# EAGLE design board (EAGLE 6.6.0)
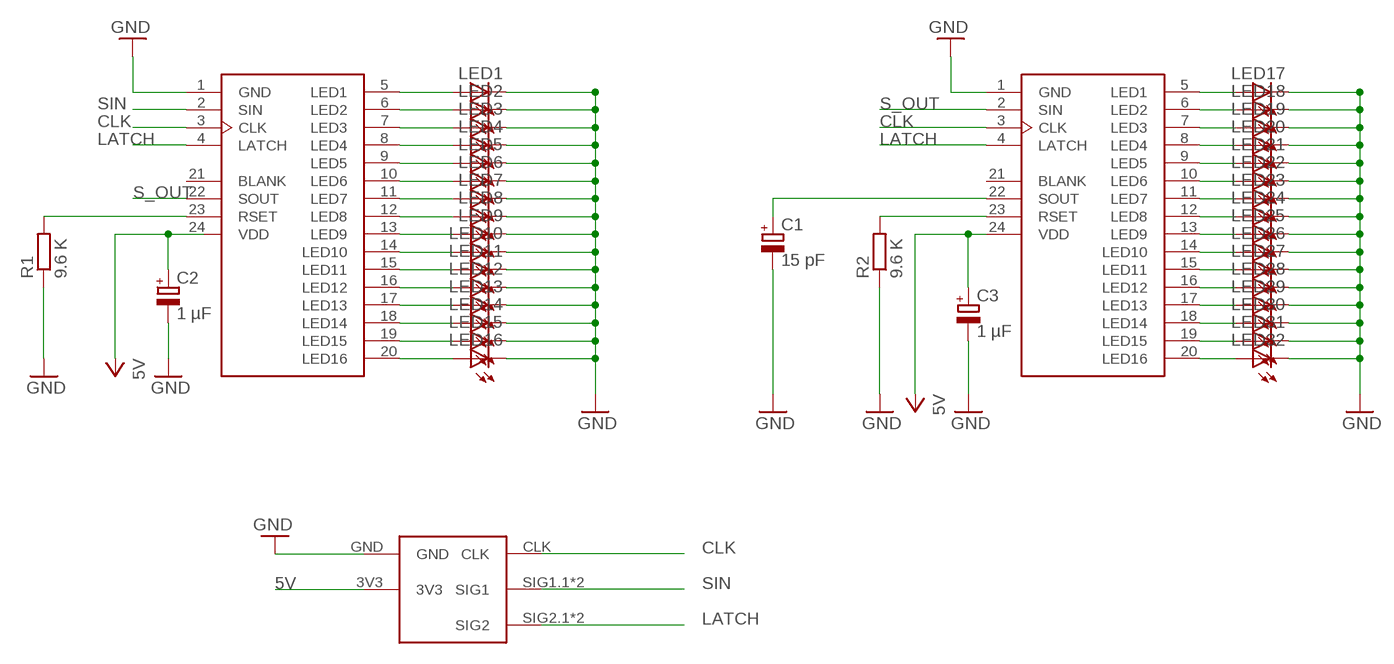
[diagram p0: schematic, sheet 1]

## Parts
C1  15 pF  CPOL-EUE5-8.5  [E5-8,5]
C2  1 µF  CPOL-EUE5-8.5  [E5-8,5]
C3  1 µF  CPOL-EUE5-8.5  [E5-8,5]
IC1  CAT4016  [SOIC24W]
IC2  CAT4016  [SOIC24W]
LED1  LEDCHIPLED-0603-TTW  [CHIPLED-0603-TTW]
LED2  LEDCHIPLED-0603-TTW  [CHIPLED-0603-TTW]
LED3  LEDCHIPLED-0603-TTW  [CHIPLED-0603-TTW]
LED4  LEDCHIPLED-0603-TTW  [CHIPLED-0603-TTW]
LED5  LEDCHIPLED-0603-TTW  [CHIPLED-0603-TTW]
LED6  LEDCHIPLED-0603-TTW  [CHIPLED-0603-TTW]
LED7  LEDCHIPLED-0603-TTW  [CHIPLED-0603-TTW]
LED8  LEDCHIPLED-0603-TTW  [CHIPLED-0603-TTW]
LED9  LEDCHIPLED-0603-TTW  [CHIPLED-0603-TTW]
LED10  LEDCHIPLED-0603-TTW  [CHIPLED-0603-TTW]
LED11  LEDCHIPLED-0603-TTW  [CHIPLED-0603-TTW]
LED12  LEDCHIPLED-0603-TTW  [CHIPLED-0603-TTW]
LED13  LEDCHIPLED-0603-TTW  [CHIPLED-0603-TTW]
LED14  LEDCHIPLED-0603-TTW  [CHIPLED-0603-TTW]
LED15  LEDCHIPLED-0603-TTW  [CHIPLED-0603-TTW]
LED16  LEDCHIPLED-0603-TTW  [CHIPLED-0603-TTW]
LED17  LEDCHIPLED-0603-TTW  [CHIPLED-0603-TTW]
LED18  LEDCHIPLED-0603-TTW  [CHIPLED-0603-TTW]
LED19  LEDCHIPLED-0603-TTW  [CHIPLED-0603-TTW]
LED20  LEDCHIPLED-0603-TTW  [CHIPLED-0603-TTW]
LED21  LEDCHIPLED-0603-TTW  [CHIPLED-0603-TTW]
LED22  LEDCHIPLED-0603-TTW  [CHIPLED-0603-TTW]
LED23  LEDCHIPLED-0603-TTW  [CHIPLED-0603-TTW]
LED24  LEDCHIPLED-0603-TTW  [CHIPLED-0603-TTW]
LED25  LEDCHIPLED-0603-TTW  [CHIPLED-0603-TTW]
LED26  LEDCHIPLED-0603-TTW  [CHIPLED-0603-TTW]
LED27  LEDCHIPLED-0603-TTW  [CHIPLED-0603-TTW]
LED28  LEDCHIPLED-0603-TTW  [CHIPLED-0603-TTW]
LED29  LEDCHIPLED-0603-TTW  [CHIPLED-0603-TTW]
LED30  LEDCHIPLED-0603-TTW  [CHIPLED-0603-TTW]
LED31  LEDCHIPLED-0603-TTW  [CHIPLED-0603-TTW]
LED32  LEDCHIPLED-0603-TTW  [CHIPLED-0603-TTW]
R1  9.6 K  R-EU_0207/10  [0207/10]
R2  9.6 K  R-EU_0207/10  [0207/10]
U$1  SLIP-RING-INVERSE  [SLIP-RING-INVERSE]

## Nets
5V: C2.+ C3.+ IC2.24(VDD) U$1.3V3
C1: C1.+ IC2.22(SOUT)
CLK: IC1.3(CLK) IC2.3(CLK) U$1.CLK
GND: C1.- C2.- C3.- IC1.1(GND) IC2.1(GND) LED1.C@1(C) LED2.C@1(C) LED3.C@1(C) LED4.C@1(C) LED5.C@1(C) LED6.C@1(C) LED7.C@1(C) LED8.C@1(C) LED9.C@1(C) LED10.C@1(C) LED11.C@1(C) LED12.C@1(C) LED13.C@1(C) LED14.C@1(C) LED15.C@1(C) LED16.C@1(C) LED17.C@1(C) LED18.C@1(C) LED19.C@1(C) LED20.C@1(C) LED21.C@1(C) LED22.C@1(C) LED23.C@1(C) LED24.C@1(C) LED25.C@1(C) LED26.C@1(C) LED27.C@1(C) LED28.C@1(C) LED29.C@1(C) LED30.C@1(C) LED31.C@1(C) LED32.C@1(C) R1.1 R2.1 U$1.GND
LATCH: IC1.4(LATCH) IC2.4(LATCH) U$1.SIG2.1(SIG2) U$1.SIG2.2(SIG2)
N$1: IC1.23(RSET) R1.2
N$2: IC2.23(RSET) R2.2
N$3: IC2.20(LED16) LED32.A@1(A)
N$4: IC2.19(LED15) LED31.A@1(A)
N$5: IC2.18(LED14) LED30.A@1(A)
N$6: IC2.17(LED13) LED29.A@1(A)
N$7: IC2.16(LED12) LED28.A@1(A)
N$8: IC2.15(LED11) LED27.A@1(A)
N$9: IC2.14(LED10) LED26.A@1(A)
N$10: IC2.13(LED9) LED25.A@1(A)
N$11: IC2.5(LED1) LED17.A@1(A)
N$12: IC2.6(LED2) LED18.A@1(A)
N$13: IC2.7(LED3) LED19.A@1(A)
N$14: IC2.8(LED4) LED20.A@1(A)
N$15: IC2.9(LED5) LED21.A@1(A)
N$16: IC2.10(LED6) LED22.A@1(A)
N$17: IC2.11(LED7) LED23.A@1(A)
N$18: IC2.12(LED8) LED24.A@1(A)
N$19: IC1.5(LED1) LED1.A@1(A)
N$20: IC1.6(LED2) LED2.A@1(A)
N$21: IC1.7(LED3) LED3.A@1(A)
N$22: IC1.8(LED4) LED4.A@1(A)
N$23: IC1.9(LED5) LED5.A@1(A)
N$24: IC1.10(LED6) LED6.A@1(A)
N$25: IC1.11(LED7) LED7.A@1(A)
N$26: IC1.12(LED8) LED8.A@1(A)
N$27: IC1.13(LED9) LED9.A@1(A)
N$28: IC1.14(LED10) LED10.A@1(A)
N$29: IC1.15(LED11) LED11.A@1(A)
N$30: IC1.16(LED12) LED12.A@1(A)
N$31: IC1.17(LED13) LED13.A@1(A)
N$32: IC1.18(LED14) LED14.A@1(A)
N$33: IC1.19(LED15) LED15.A@1(A)
N$34: IC1.20(LED16) LED16.A@1(A)
S_OUT: IC1.22(SOUT) IC2.2(SIN)
SIN: IC1.2(SIN) U$1.SIG1.1(SIG1) U$1.SIG1.2(SIG1)
Unconnected: IC1.21(BLANK) IC1.24(VDD) IC2.21(BLANK)

## Library data of the parts
C1-C3 = rcl:CPOL-EU: POLARIZED CAPACITOR, European symbol
IC1 IC2 = cat4016:CAT4016: 16-Channel Constant Current LED Driver
LED1-LED32 = led:LED: LED OSRAM: - CHIPLED LG R971, LG N971, LY N971, LG Q971, LY Q971, LO R971, LY R971 LH N974, LH R974 LS Q976, LO Q976, LY Q976 LO Q996 - Hyper CHIPLED LW Q18S LB Q993, LB Q99A, LB R99A - SideLED LS A670, LO A670, LY A670, LG A670, LP A670 LB A673, LV A673, LT A673, LW A673 LH A674 LY A675 LS A676, LA A676, LO A676, LY A676, LW A676 LS A679, LY A679, LG A679 - Hyper Micro SIDELED® LS Y876, LA Y876, LO Y876, LY Y876 LT Y87S - SmartLED LW L88C, LW L88S LB L89C, LB L89S, LG L890 LS L89K, LO L89K, LY L89K LS L896, LA L896, LO L896, LY L896 - TOPLED LS T670, LO T670, LY T670, LG T670, LP T670 LSG T670, LSP T670, LSY T670, LOP T670, LYG T670 LG T671, LOG T671, LSG T671 LB T673, LV T673, LT T673, LW T673 LH T674 LS T676, LA T676, LO T676, LY T676, LB T676, LH T676, LSB T676, LW T676 LB T67C, LV T67C, LT T67C, LS T67K, LO T67K, LY T67K, LW E67C LS E67B, LA E67B, LO E67B, LY E67B, LB E67C, LV E67C, LT E67C LW T67C LS T679, LY T679, LG T679 LS T770, LO T770, LY T770, LG T770, LP T770 LB T773, LV T773, LT T773, LW T773 LH T774 LS E675, LA E675, LY E675, LS T675 LS T776, LA T776, LO T776, LY T776, LB T776 LHGB T686 LT T68C, LB T68C - Hyper Mini TOPLED® LB M676 - Mini TOPLED Santana® LG M470 LS M47K, LO M47K, LY M47K Source: http://www.osram.convergy.de LUXEON: - LUMILED® LXK2-PW12-R00, LXK2-PW12-S00, LXK2-PW14-U00, LXK2-PW14-V00 LXK2-PM12-R00, LXK2-PM12-S00, LXK2-PM14-U00 LXK2-PE12-Q00, LXK2-PE12-R00, LXK2-PE12-S00, LXK2-PE14-T00, LXK2-PE14-U00 LXK2-PB12-K00, LXK2-PB12-L00, LXK2-PB12-M00, LXK2-PB14-N00, LXK2-PB14-P00, LXK2-PB14-Q00 LXK2-PR12-L00, LXK2-PR12-M00, LXK2-PR14-Q00, LXK2-PR14-R00 LXK2-PD12-Q00, LXK2-PD12-R00, LXK2-PD12-S00 LXK2-PH12-R00, LXK2-PH12-S00 LXK2-PL12-P00, LXK2-PL12-Q00, LXK2-PL12-R00 Source: www.luxeon.com KINGBRIGHT: KA-3528ASYC Source: www.kingbright.com
R1 R2 = resistor:R-EU_: RESISTOR, European symbol
U$1 = slip_ring:SLIP-RING-INVERSE

## Board
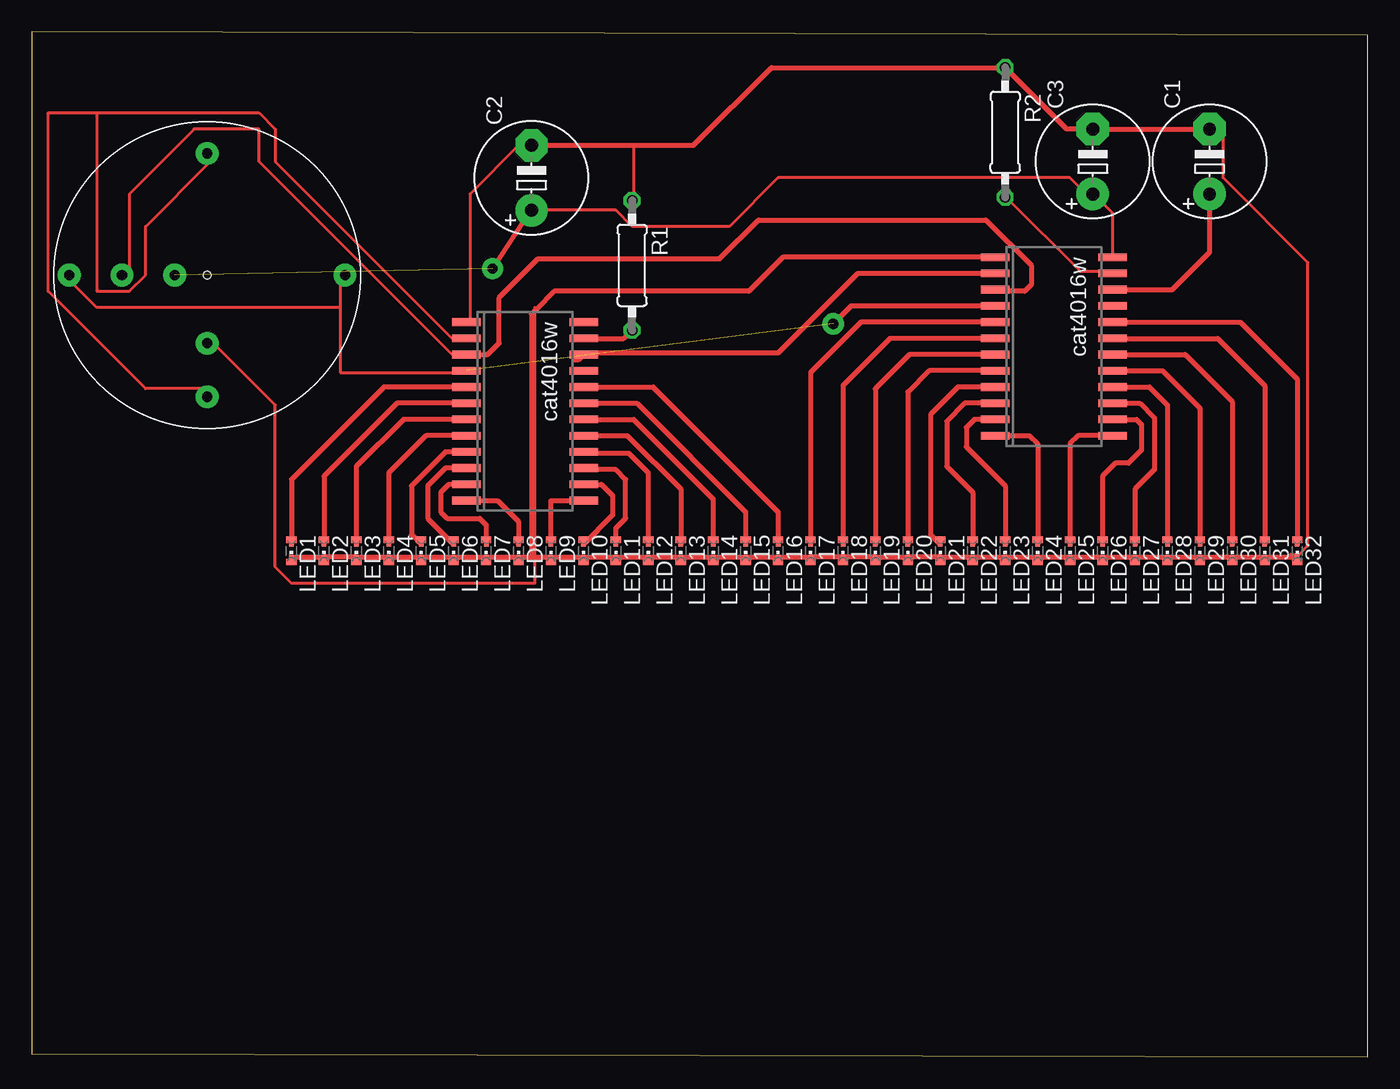
[diagram p1: board, top side]
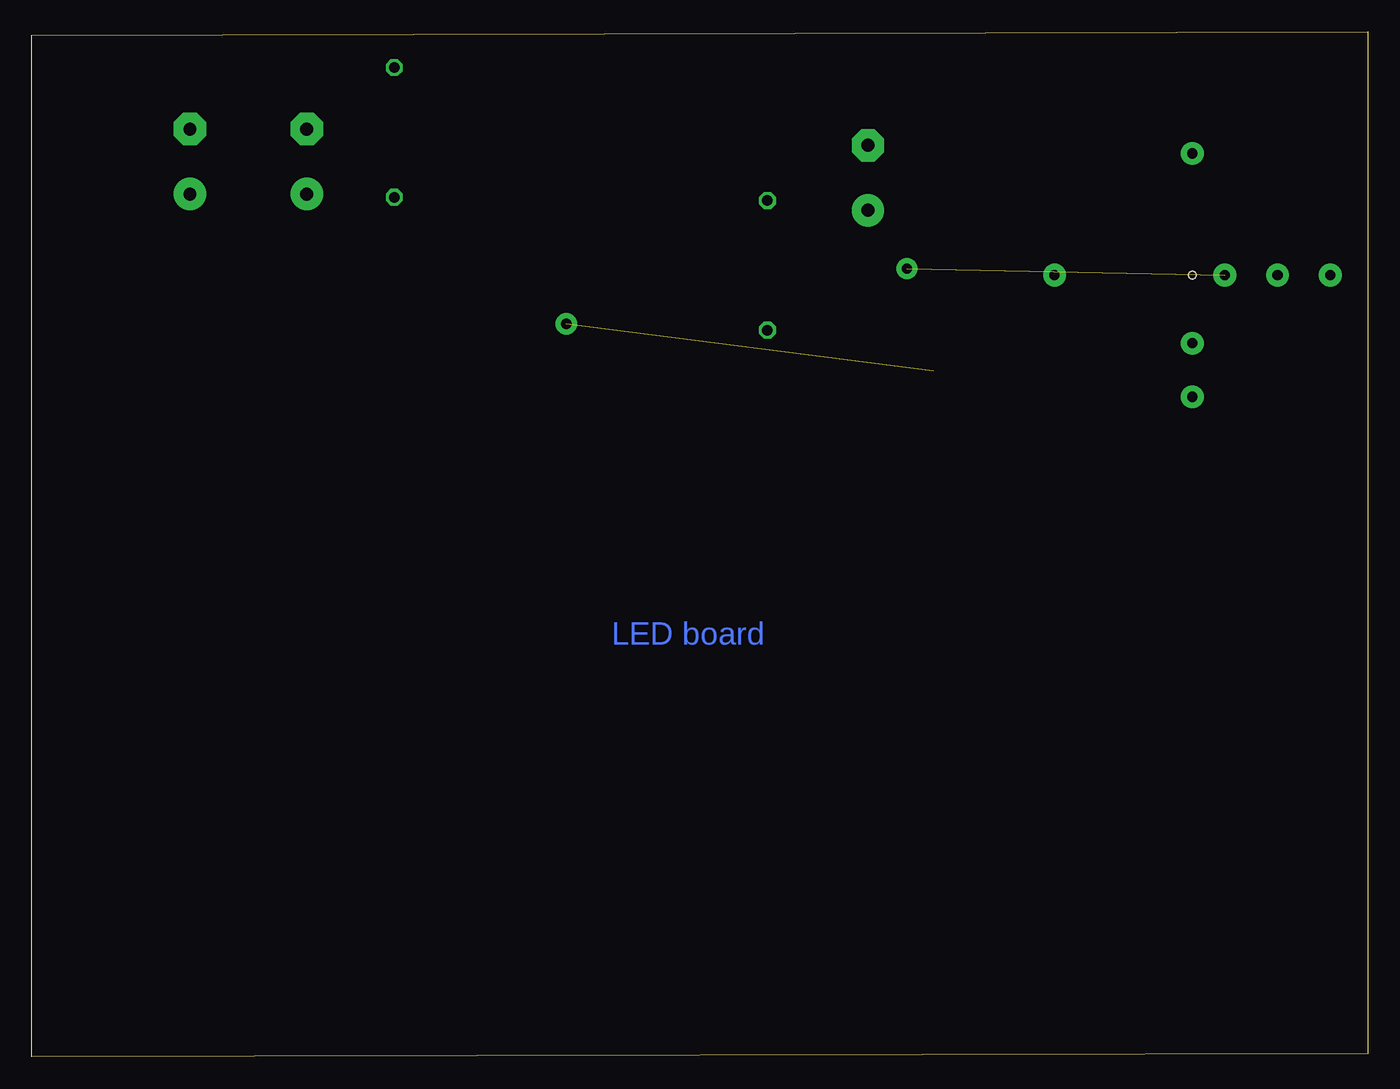
[diagram p2: board, bottom side, seen from below]

Size 104.57 x 80.25 mm. Coordinates in mm from the lower left corner, seen from the top.
Outline: 0,0.25 104.57,0 104.57,80 0,80.25 0,0.25
Copper layers (1*16): Top 0.035mm / dielectric 1.5mm / Bottom 0.035mm
Design rules "default": minimum track width 10mil, minimum drill 24mil, track to track 8mil, track to pad 8mil, pad to pad 8mil, via to via 8mil, smd to smd 8mil, copper to edge 40mil, drill to drill 8mil, minimum pad ring 10mil, minimum via ring 8mil, stop-mask expansion 4mil, vias tented up to drill 0mil, thermal gap 10mil

### Footprints (pad centres in the part's own frame; a part is rotated, then mirrored left to right if it is on the bottom)
E5-8,5 = drill 1.016 pad 2.54: + -2.54,0 | drill 1.016 pad 2.54 octagon: - 2.54,0
SOIC24W = smd 0.6 x 2.2: 1 -6.985,-4.6; 2 -5.715,-4.6; 3 -4.445,-4.6; 4 -3.175,-4.6; 5 -1.905,-4.6; 6 -0.635,-4.6; 7 0.635,-4.6; 8 1.905,-4.6; 9 3.175,-4.6; 10 4.445,-4.6; 11 5.715,-4.6; 12 6.985,-4.6; 13 6.985,4.6; 14 5.715,4.6; 15 4.445,4.6; 16 3.175,4.6; 17 1.905,4.6; 18 0.635,4.6; 19 -0.635,4.6; 20 -1.905,4.6; 21 -3.175,4.6; 22 -4.445,4.6; 23 -5.715,4.6; 24 -6.985,4.6
CHIPLED-0603-TTW = smd 0.8 x 0.5: A 0,-0.875; C 0,0.875 | smd 0.35 x 0.35: A@1 0,-0.5; C@1 0,0.5
0207/10 = drill 0.813 octagon: 1 -5.08,0; 2 5.08,0
SLIP-RING-INVERSE = drill 0.8 pad 1.778: 3V3 2.54,0; CLK 6.668,0; GND 0,5.334; SIG1.1 0,9.525; SIG1.2 0,-9.525; SIG2.1 -10.795,0; SIG2.2 10.795,0 | hole 0.6: 0,0

### Placement (x,y rotation side)
C1  92.2,70.1 90 top
C2  39.12,68.83 90 top
C3  83.06,70.1 90 top
IC1  38.61,50.55 270 top
IC2  80.01,55.63 270 top
LED1  20.32,39.62 180 top
LED2  22.86,39.62 180 top
LED3  25.4,39.62 180 top
LED4  27.94,39.62 180 top
LED5  30.48,39.62 180 top
LED6  33.02,39.62 180 top
LED7  35.56,39.62 180 top
LED8  38.1,39.62 180 top
LED9  40.64,39.62 180 top
LED10  43.18,39.62 180 top
LED11  45.72,39.62 180 top
LED12  48.26,39.62 180 top
LED13  50.8,39.62 180 top
LED14  53.34,39.62 180 top
LED15  55.88,39.62 180 top
LED16  58.42,39.62 180 top
LED17  60.96,39.62 180 top
LED18  63.5,39.62 180 top
LED19  66.04,39.62 180 top
LED20  68.58,39.62 180 top
LED21  71.12,39.62 180 top
LED22  73.66,39.62 180 top
LED23  76.2,39.62 180 top
LED24  78.74,39.62 180 top
LED25  81.28,39.62 180 top
LED26  83.82,39.62 180 top
LED27  86.36,39.62 180 top
LED28  88.9,39.62 180 top
LED29  91.44,39.62 180 top
LED30  93.98,39.62 180 top
LED31  96.52,39.62 180 top
LED32  99.06,39.62 180 top
R1  46.99,61.98 270 top
R2  76.2,72.39 270 top
U$1  13.72,61.21 180 top

### Tracks (layer width: path | path; a pad name or v marks a point on that pad's centre or on a via)
5V  (1 unrouted)
  Top 0.254: IC2.24 84.58,62.66 84.58,66.09 83.21,67.46 C3.+ 82.55,67.56 81.28,68.83 58.42,68.83 54.61,65.02 46.99,65.02 45.72,66.29 C2.+ 39.09,66.32
  Top 0.406: 39.09,66.32 36.07,61.72
C1
  Top 0.406: IC2.22 89.28,60.07 92.2,62.99 C1.+
CLK
  Top 0.254: U$1.CLK 7.62,61.21 7.62,67.56 12.7,72.64 17.78,72.64 17.78,70.1 33.02,54.86 IC1.3
  Top 0.406: IC1.3 35.69,54.99 36.58,55.88 36.58,59.44 39.62,62.48 53.85,62.48 56.9,65.53 74.68,65.53 78.23,61.98 78.23,60.45 77.72,59.94 75.54,59.94 IC2.3
GND
  Top 0.254: 92.13,72.64 92.13,72.72 C1.- 93.27,72.49 93.27,68.83 99.9,62.2 99.9,40.03 99.21,39.34 98.53,39.34 98.3,39.12 | 34.06,57.63 IC1.1 34.29,57.4 34.29,67.56 38.1,71.37 C2.- | 47.09,71.37 47.09,67.23 R1.1 | 76.71,76.96 76.58,77.06 76.35,77.29 R2.1 | U$1.GND 13.97,56.13 19.05,51.05 19.05,38.35 20.32,37.08 39.37,37.08 39.37,58.67 39.5,58.55
  Top 0.406: LED1.C@1 LED2.C@1 LED3.C@1 LED4.C@1 LED5.C@1 LED6.C@1 LED7.C@1 LED8.C@1 39.12,39.12 | 39.12,39.12 LED9.C@1 LED10.C@1 LED11.C@1 LED12.C@1 LED13.C@1 LED14.C@1 LED15.C@1 LED16.C@1 LED17.C@1 LED18.C@1 LED19.C@1 LED20.C@1 LED21.C@1 LED22.C@1 LED23.C@1 LED24.C@1 LED25.C@1 LED26.C@1 LED27.C@1 LED28.C@1 LED29.C@1 LED30.C@1 LED31.C@1 98.3,39.12 LED32.C@1 | IC2.1 58.8,62.61 56.13,59.94 40.89,59.94 39.5,58.55 39.12,58.17 39.12,39.12 | 76.71,76.96 81.03,72.64 C3.- 92.13,72.64 C1.- 93.22,72.64 | C2.- 39.62,71.37 | 39.62,71.37 47.09,71.37 51.82,71.37 57.91,77.47 R2.1 | 39.37,71.63 39.62,71.37
LATCH  (1 unrouted)
  Top 0.254: 33.83,53.75 IC1.4 33.02,53.59 24.13,53.59 24.13,58.67 | 24.13,58.67 24.13,61.21 U$1.SIG2.1 | 24.13,58.67 5.08,58.67 2.54,61.21 U$1.SIG2.2
  Top 0.406: IC2.4 64.14,58.8 62.74,57.4
N$1
  Top 0.406: IC1.23 46.35,56.26 R1.2
N$2
  Top 0.254: IC2.23 84.58,61.52 82.07,61.52 76.35,67.23 R2.2
N$3
  Top 0.406: IC2.20 94.61,57.53 99.06,53.09 LED32.A@1
N$4
  Top 0.406: IC2.19 92.84,56.26 96.52,52.58 LED31.A@1
N$5
  Top 0.406: IC2.18 90.3,54.99 93.98,51.31 LED30.A@1
N$6
  Top 0.406: IC2.17 88.52,53.72 91.44,50.8 LED29.A@1
N$7
  Top 0.406: IC2.16 87.5,52.45 88.9,51.05 LED28.A@1
N$8
  Top 0.406: IC2.15 86.74,51.18 87.88,50.04 87.88,45.97 86.36,44.45 LED27.A@1
N$9
  Top 0.406: IC2.14 86.49,49.91 86.87,49.53 86.87,47.5 85.85,46.48 84.84,46.48 83.82,45.47 LED26.A@1
N$10
  Top 0.406: IC2.13 81.92,48.64 81.28,48.01 LED25.A@1
N$11
  Top 0.406: IC2.5 64.9,57.53 60.96,53.59 LED17.A@1
N$12
  Top 0.406: IC2.6 67.18,56.26 63.5,52.58 LED18.A@1
N$13
  Top 0.406: IC2.7 68.71,54.99 66.04,52.32 LED19.A@1
N$14
  Top 0.406: IC2.8 70.23,53.72 68.58,52.07 LED20.A@1
N$15
  Top 0.406: IC2.9 72.52,52.45 70.36,50.29 70.36,40.89 LED21.A@1
N$16
  Top 0.406: IC2.10 73.03,51.18 71.63,49.78 71.63,46.23 73.66,44.2 LED22.A@1
N$17
  Top 0.406: IC2.11 73.79,49.91 73.15,49.28 73.15,47.75 76.2,44.7 LED23.A@1
N$18
  Top 0.406: IC2.12 78.11,48.64 78.74,48.01 LED24.A@1
N$19
  Top 0.406: IC1.5 27.56,52.45 20.32,45.21 LED1.A@1
N$20
  Top 0.406: IC1.6 28.57,51.18 22.86,45.47 LED2.A@1
N$21
  Top 0.406: IC1.7 29.08,49.91 25.4,46.23 LED3.A@1
N$22
  Top 0.406: IC1.8 30.86,48.64 27.94,45.72 LED4.A@1
N$23
  Top 0.406: IC1.9 32.38,47.37 29.72,44.7 29.72,40.89 LED5.A@1
N$24
  Top 0.406: IC1.10 32.38,46.1 30.99,44.7 30.99,42.16 LED6.A@1
N$25
  Top 0.406: IC1.11 32.64,44.83 32,44.2 32,42.67 32.51,42.16 35.05,42.16 35.56,41.66 LED7.A@1
N$26
  Top 0.406: IC1.12 36.45,43.56 38.1,41.91 LED8.A@1
N$27
  Top 0.406: LED9.A@1 40.64,43.56 IC1.13
N$28
  Top 0.406: IC1.14 44.58,44.83 45.47,43.94 45.47,42.41 LED10.A@1
N$29
  Top 0.406: LED11.A@1 45.72,41.4 46.48,42.16 46.48,45.21 45.72,45.97 43.34,45.97 IC1.15
N$30
  Top 0.406: LED12.A@1 48.26,45.72 46.74,47.24 43.34,47.24 IC1.16
N$31
  Top 0.406: IC1.17 46.61,48.64 50.8,44.45 LED13.A@1
N$32
  Top 0.406: IC1.18 47.12,49.91 53.34,43.69 LED14.A@1
N$33
  Top 0.406: IC1.19 47.37,51.18 55.88,42.67 LED15.A@1
N$34
  Top 0.406: IC1.20 48.64,52.45 58.42,42.67 LED16.A@1
N$35  (via drill 0.8 pad 1.68)
  other vias: 36.07,61.72
N$37  (via drill 0.8 pad 1.68)
  other vias: 62.74,57.4
S_OUT
  Top 0.406: IC2.2 64.64,61.34 58.42,55.12 42.93,55.12 42.42,54.61 42.83,54.61 IC1.22
SIN
  Top 0.254: 5.08,73.91 1.27,73.91 1.27,59.94 8.89,52.32 13.97,52.32 U$1.SIG1.1 | 5.08,73.91 17.78,73.91 19.05,72.64 19.05,70.1 33.02,56.13 IC1.2 | 5.08,73.91 5.08,59.94 7.62,59.94 8.89,61.21 8.89,65.02 13.97,70.1 U$1.SIG1.2

### Text on the board
Bottom: LED board